# EAGLE design Stepper (EAGLE 9.6.2)
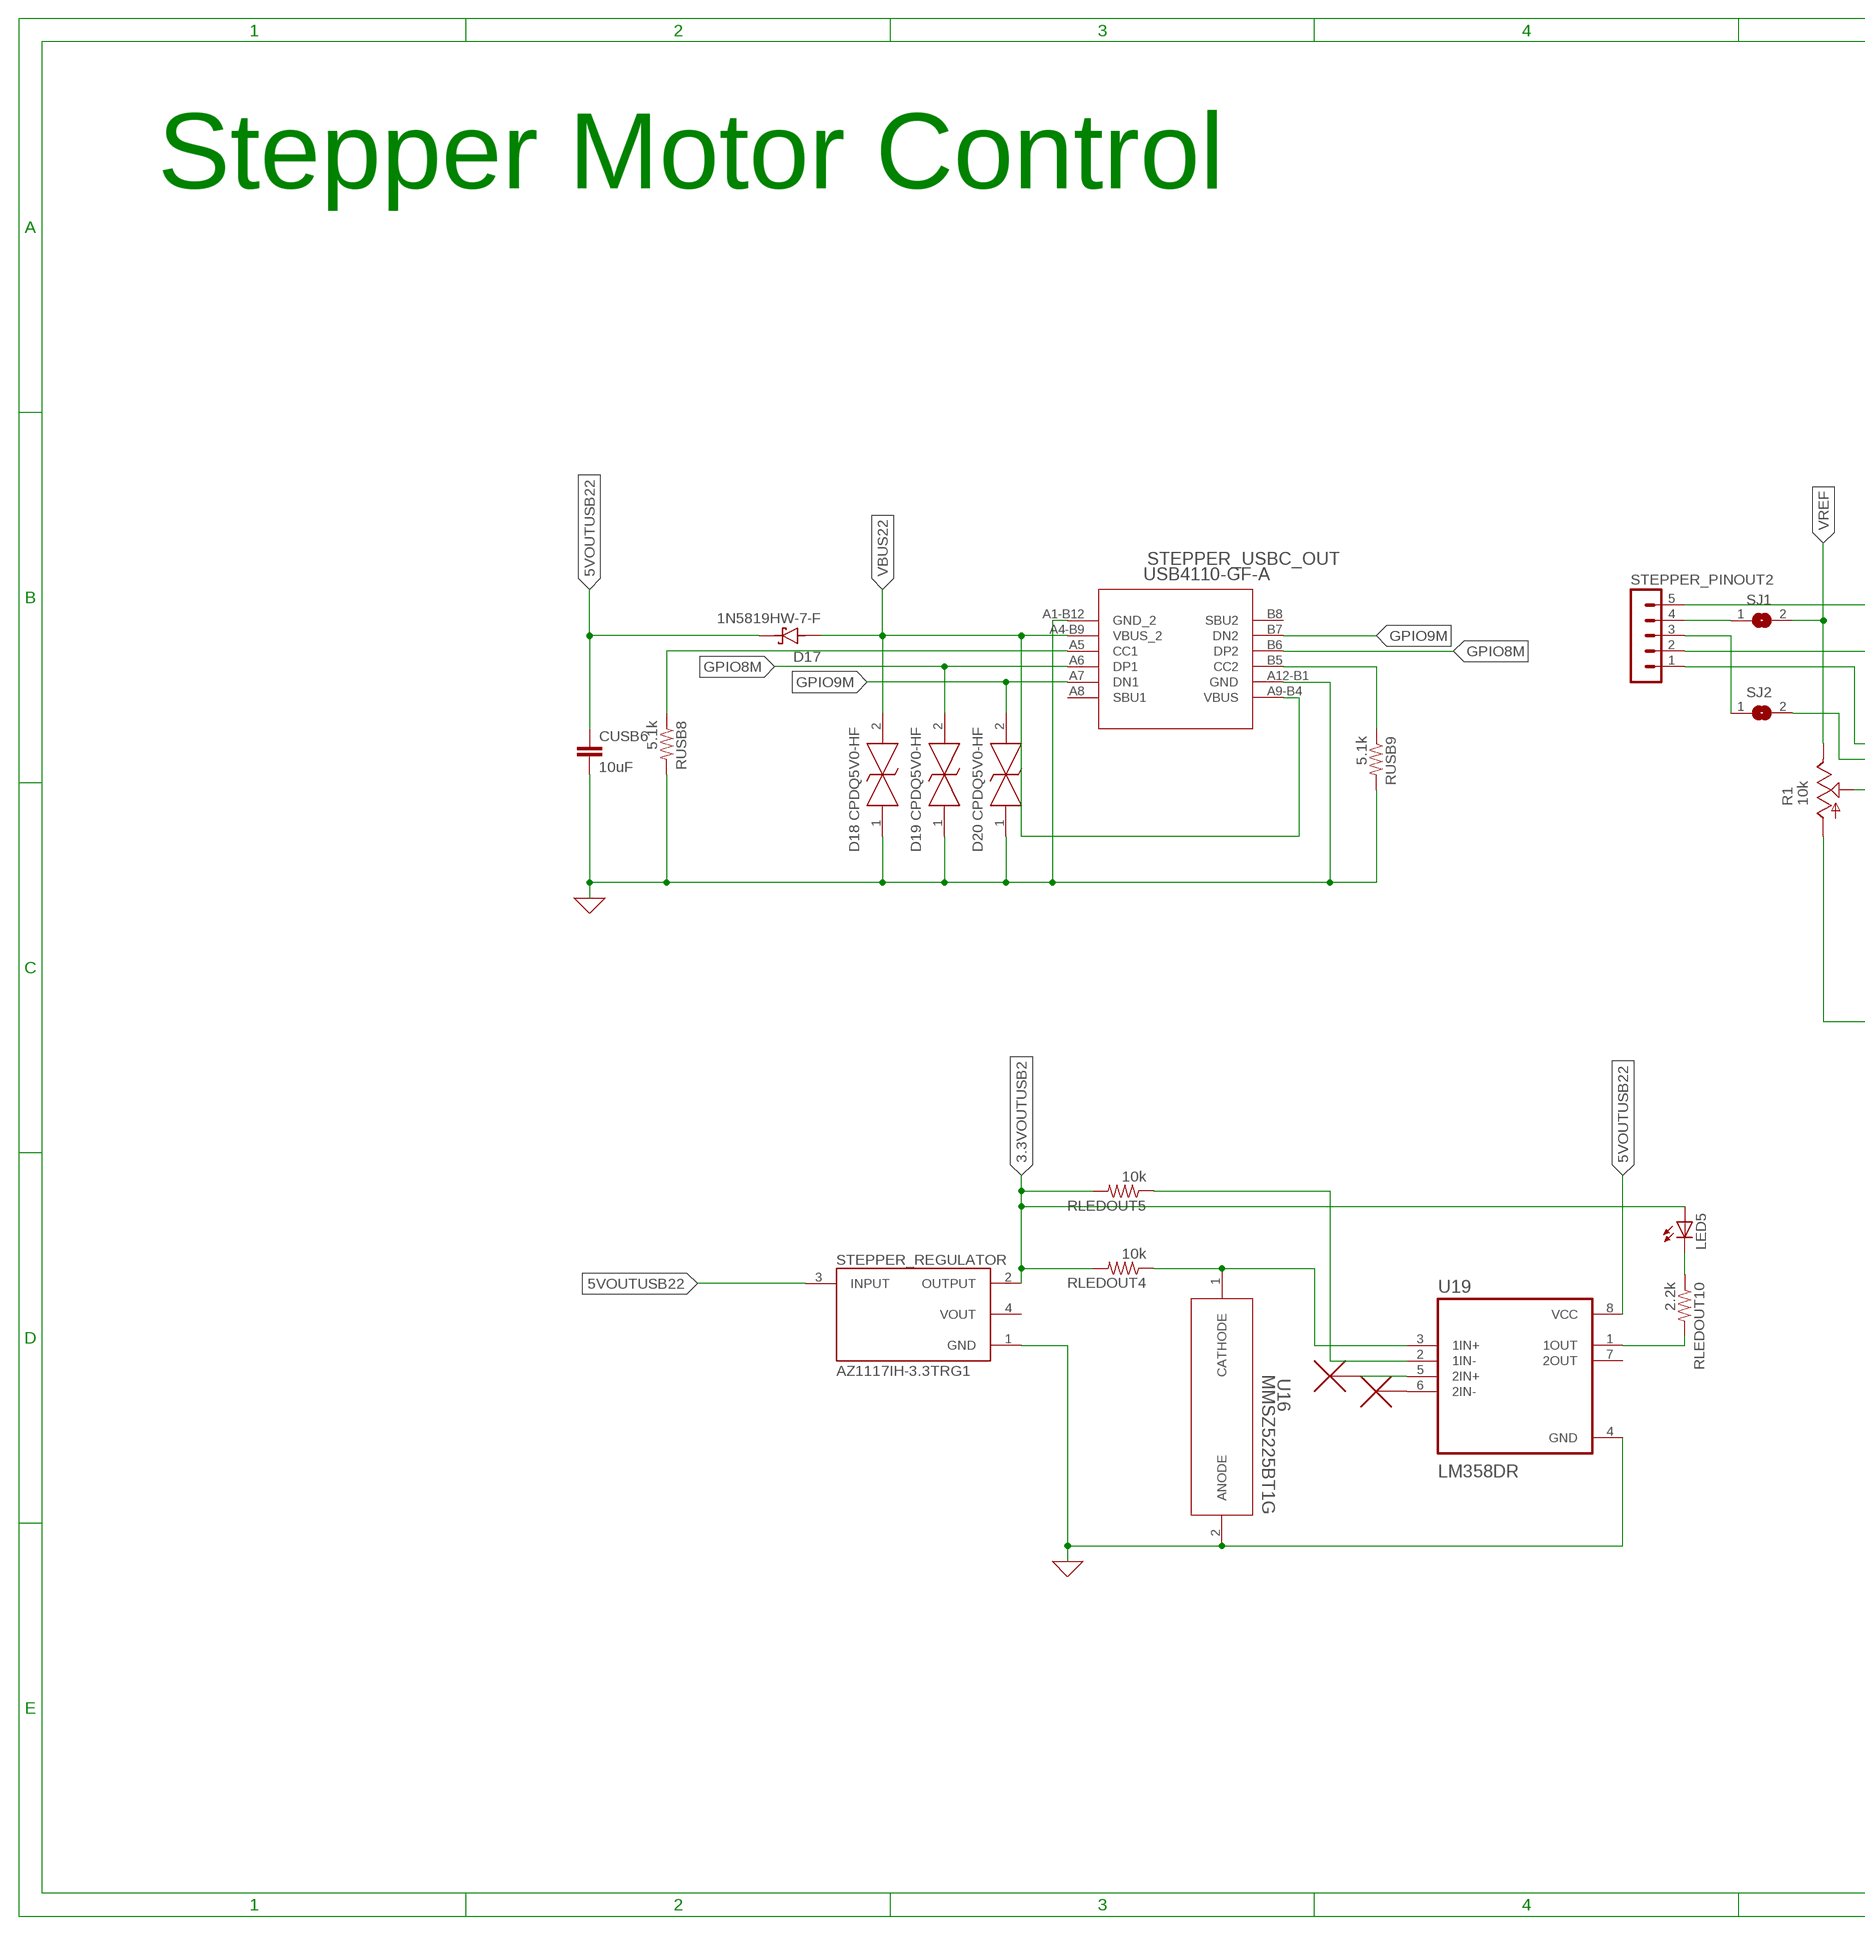
[diagram p0: schematic, sheet 1, part 1 of 2]
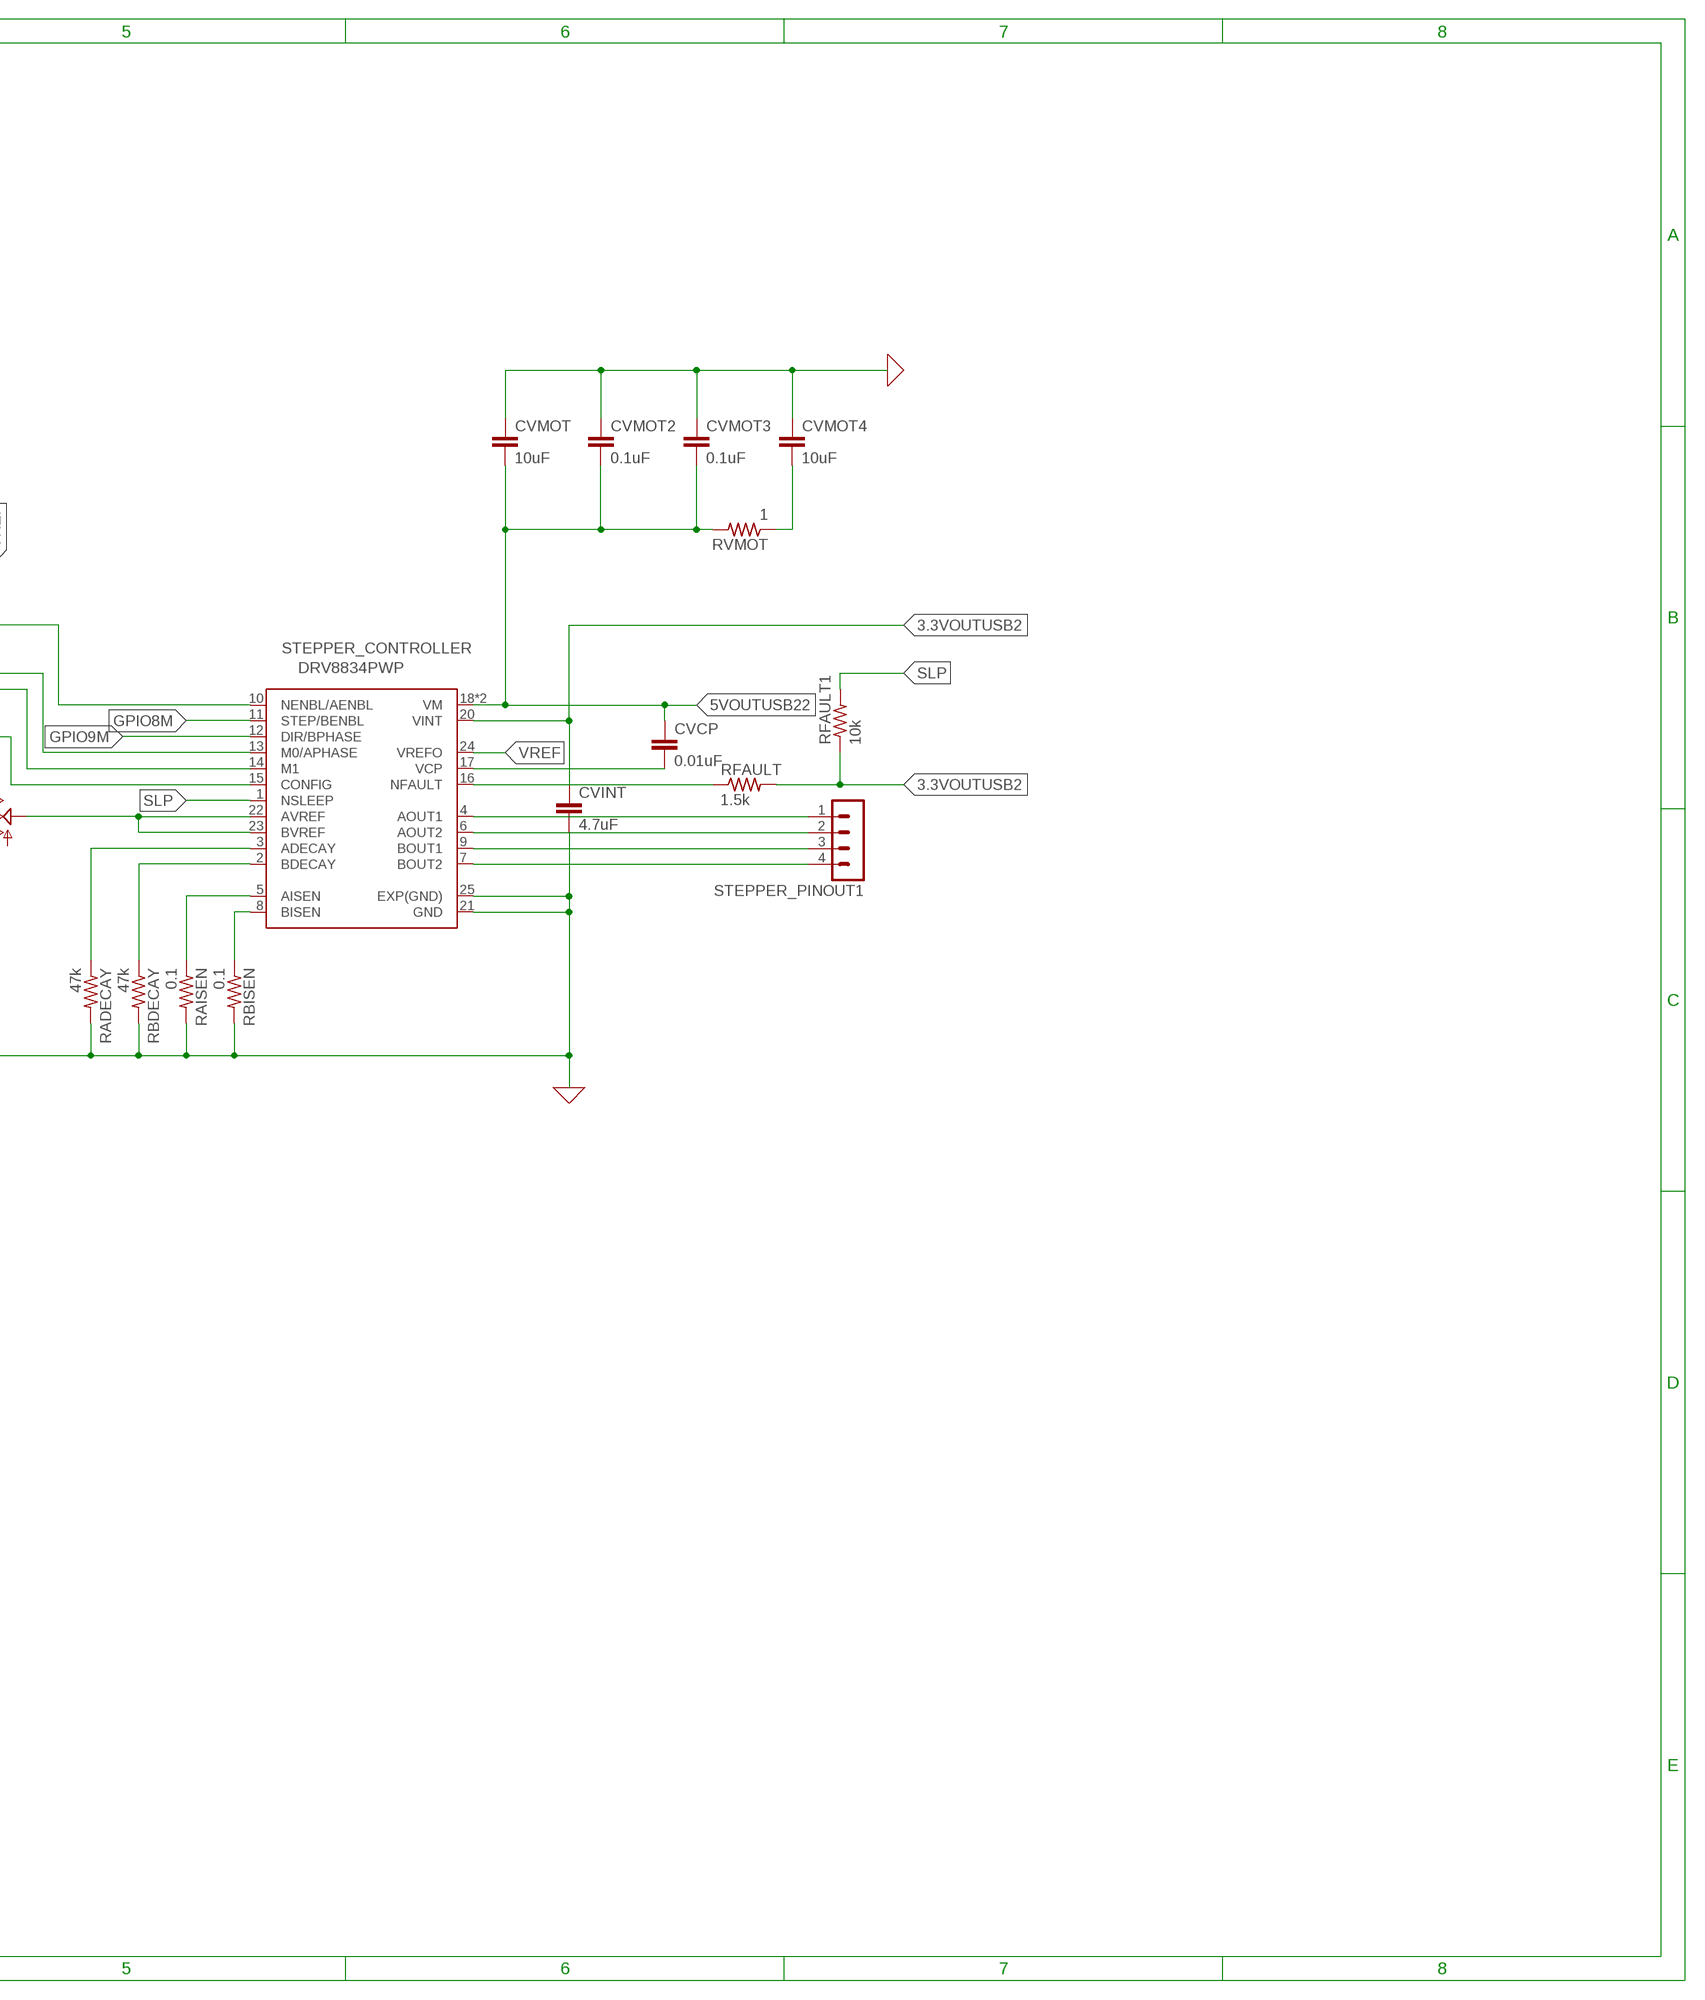
[diagram p1: schematic, sheet 1, part 2 of 2]

## Parts
CUSB6  10uF  C-EUC0805  [C0805]
CVCP  0.01uF  C-EUC0805  [C0805]
CVINT  4.7uF  C-EUC0805  [C0805]
CVMOT  10uF  C-EUC0805  [C0805]
CVMOT2  0.1uF  C-EUC0805  [C0805]
CVMOT3  0.1uF  C-EUC0805  [C0805]
CVMOT4  10uF  C-EUC0805  [C0805]
D17  1N5819HW-7-F  [SOD3715X145N]
D18  CPDQ5V0-HF  [MBTB-D-SOD-923F-IMP-0402]
D19  CPDQ5V0-HF  [MBTB-D-SOD-923F-IMP-0402]
D20  CPDQ5V0-HF  [MBTB-D-SOD-923F-IMP-0402]
LED5  LED  [SMARTLED-TTW]
R1  10k  TRIM_US-3223G  [3223G]
RADECAY  47k  R-US_M0805  [M0805]
RAISEN  0.1  R-US_M0805  [M0805]
RBDECAY  47k  R-US_M0805  [M0805]
RBISEN  0.1  R-US_M0805  [M0805]
RFAULT  1.5k  R-US_M0805  [M0805]
RFAULT1  10k  R-US_M0805  [M0805]
RLEDOUT4  10k  R-US_M0805  [M0805]
RLEDOUT5  10k  R-US_M0805  [M0805]
RLEDOUT10  2.2k  R-US_M0805  [M0805]
RUSB8  5.1k  R-US_M0805  [M0805]
RUSB9  5.1k  R-US_M0805  [M0805]
RVMOT  1  R-US_M0805  [M0805]
SJ1  SJ  [SJ]
SJ2  SJ  [SJ]
STEPPER_CONTROLLER  DRV8834PWP  [SOP65P640X120-25N]
STEPPER_PINOUT1  MA04-1  [MA04-1]
STEPPER_PINOUT2  MA05-1  [MA05-1]
STEPPER_REGULATOR  AZ1117IH-3.3TRG1  [SOT230P700X185-4N]
STEPPER_USBC_OUT  USB4110-GF-A  [USB4110-GF-A_GCT]
U16  MMSZ5225BT1G  [SOD-123_ONS]
U19  LM358DR  [SOIC127P599X175-8N]
U$8  NC_MARKER  (no package)
U$9  NC_MARKER  (no package)

## Nets
3.3VOUTUSB2: CVINT.1 LED5.A@1(A) RFAULT1.1 RFAULT.2 RLEDOUT4.2 RLEDOUT5.2 STEPPER_CONTROLLER.20(VINT) STEPPER_REGULATOR.2(OUTPUT)
5VOUTUSB22: CUSB6.1 CVCP.1 CVMOT2.2 CVMOT3.2 CVMOT.2 D17.C(K) RVMOT.2 STEPPER_CONTROLLER.18(VM) STEPPER_CONTROLLER.19(VM) STEPPER_REGULATOR.3(INPUT) U19.8(VCC)
GND: CUSB6.2 CVINT.2 CVMOT2.1 CVMOT3.1 CVMOT4.1 CVMOT.1 D18.1(K) D19.1(K) D20.1(K) R1.1(A) RADECAY.2 RAISEN.2 RBDECAY.2 RBISEN.2 RUSB8.2 RUSB9.2 STEPPER_CONTROLLER.21(GND) STEPPER_CONTROLLER.25(EXP(GND)) STEPPER_REGULATOR.1(GND) STEPPER_USBC_OUT.A1-B12(GND_2) STEPPER_USBC_OUT.A12-B1(GND) U16.2(ANODE) U19.4(GND)
GPIO8M: D19.2(A) STEPPER_CONTROLLER.11(STEP/BENBL) STEPPER_USBC_OUT.A6(DP1) STEPPER_USBC_OUT.B6(DP2)
GPIO9M: D20.2(A) STEPPER_CONTROLLER.12(DIR/BPHASE) STEPPER_USBC_OUT.A7(DN1) STEPPER_USBC_OUT.B7(DN2)
N$20: CVMOT4.2 RVMOT.1
N$21: RBISEN.1 STEPPER_CONTROLLER.8(BISEN)
N$23: RAISEN.1 STEPPER_CONTROLLER.5(AISEN)
N$24: RBDECAY.1 STEPPER_CONTROLLER.2(BDECAY)
N$25: RADECAY.1 STEPPER_CONTROLLER.3(ADECAY)
N$27: RFAULT.1 STEPPER_CONTROLLER.16(NFAULT)
N$28: STEPPER_CONTROLLER.4(AOUT1) STEPPER_PINOUT1.1
N$29: STEPPER_CONTROLLER.6(AOUT2) STEPPER_PINOUT1.2
N$30: STEPPER_CONTROLLER.9(BOUT1) STEPPER_PINOUT1.3
N$31: STEPPER_CONTROLLER.7(BOUT2) STEPPER_PINOUT1.4
N$32: CVCP.2 STEPPER_CONTROLLER.17(VCP)
N$33: R1.2(S) STEPPER_CONTROLLER.22(AVREF) STEPPER_CONTROLLER.23(BVREF)
N$34: SJ1.1 STEPPER_PINOUT2.4
N$35: SJ2.1 STEPPER_PINOUT2.3
N$36: SJ2.2 STEPPER_CONTROLLER.15(CONFIG)
N$37: STEPPER_CONTROLLER.14(M1) STEPPER_PINOUT2.1
N$38: STEPPER_CONTROLLER.13(M0/APHASE) STEPPER_PINOUT2.2
N$72: RUSB8.1 STEPPER_USBC_OUT.A5(CC1)
N$73: RUSB9.1 STEPPER_USBC_OUT.B5(CC2)
N$82: RLEDOUT4.1 U16.1(CATHODE) U19.3(1IN+)
N$83: RLEDOUT5.1 U19.2(1IN-)
N$84: RLEDOUT10.2 U19.1(1OUT)
N$87: U19.6(2IN-) U$9.P$1
N$88: LED5.C@1(C) RLEDOUT10.1
N$89: U19.5(2IN+) U$8.P$1
N$90: STEPPER_CONTROLLER.10(NENBL/AENBL) STEPPER_PINOUT2.5
SLP: RFAULT1.2 STEPPER_CONTROLLER.1(NSLEEP)
VBUS22: D17.A D18.2(A) STEPPER_USBC_OUT.A4-B9(VBUS_2) STEPPER_USBC_OUT.A9-B4(VBUS)
VREF: R1.3(E) SJ1.2 STEPPER_CONTROLLER.24(VREFO)
Unconnected: STEPPER_REGULATOR.4(VOUT) STEPPER_USBC_OUT.A8(SBU1) STEPPER_USBC_OUT.B8(SBU2) U19.7(2OUT)

## Notes on the sheet
- Stepper Motor Control

## Library data of the parts
CUSB6 CVCP CVINT CVMOT CVMOT2-CVMOT4 = rcl:C-EU: CAPACITOR, European symbol; SPICEPREFIX: C
D17 = 1N5819HW-7-F:1N5819HW-7-F: 1N5819HW Series 40 V 1 A Surface Mount Schottky Barrier Rectifier - SOD-123 Check availability <https://pricing.snapeda.com/parts/1N5819HW-7-F/Diodes%20Inc./view-part?ref=eda>; AVAILABILITY: In Stock; CHECK_PRICES: https://www.snapeda.com/parts/1N5819HW-7-F/Diodes+Inc./view-part/?ref=eda; DESCRIPTION: Diode Schottky 1A 40V SOD123 | Diodes Inc 1N5819HW-7-F; MF: Diodes Inc.; MP: 1N5819HW-7-F; PACKAGE: SOD-123 Fairchild Semiconductor; PRICE: None; PURCHASE-URL: https://www.snapeda.com/api/url_track_click_mouser/?unipart_id=42272&manufacturer=Diodes Inc.&part_name=1N5819HW-7-F&search_term=1n5819hw-7-f; SNAPEDA_LINK: https://www.snapeda.com/parts/1N5819HW-7-F/Diodes+Inc./view-part/?ref=snap
D18-D20 = CPDQ5V0-HF:CPDQ5V0-HF: ESD Suppressors / TVS Diodes SMD ESD Diode 5V Bi-Direction Source: Datasheet <https://componentsearchengine.com/Datasheets/1/CPDQ5V0-HF.pdf> Check availability <https://pricing.snapeda.com/parts/CPDQ5V0-HF/Comchip%20Technology/view-part?ref=eda>; AVAILABILITY: In Stock; CHECK_PRICES: https://www.snapeda.com/parts/CPDQ5V0-HF/Comchip+Technology/view-part/?ref=eda; DESCRIPTION: 18.6V Clamp 9.4A (8/20µs) Ipp Tvs Diode Surface Mount 0402/SOD-923F; MF: Comchip Technology; MP: CPDQ5V0-HF; PACKAGE: 0402 Comchip; PRICE: None; PURCHASE-URL: https://www.snapeda.com/api/url_track_click_mouser/?unipart_id=809934&manufacturer=Comchip Technology&part_name=CPDQ5V0-HF&search_term=cpdq5v0-hf; SNAPEDA_LINK: https://www.snapeda.com/parts/CPDQ5V0-HF/Comchip+Technology/view-part/?ref=snap
LED5 = adafruit:LED: LED OSRAM: - CHIPLED LG R971, LG N971, LY N971, LG Q971, LY Q971, LO R971, LY R971 LH N974, LH R974 LS Q976, LO Q976, LY Q976 LO Q996 - Hyper CHIPLED LW Q18S LB Q993, LB Q99A, LB R99A - SideLED LS A670, LO A670, LY A670, LG A670, LP A670 LB A673, LV A673, LT A673, LW A673 LH A674 LY A675 LS A676, LA A676, LO A676, LY A676, LW A676 LS A679, LY A679, LG A679 - Hyper Micro SIDELED® LS Y876, LA Y876, LO Y876, LY Y876 LT Y87S - SmartLED LW L88C, LW L88S LB L89C, LB L89S, LG L890 LS L89K, LO L89K, LY L89K LS L896, LA L896, LO L896, LY L896 - TOPLED LS T670, LO T670, LY T670, LG T670, LP T670 LSG T670, LSP T670, LSY T670, LOP T670, LYG T670 LG T671, LOG T671, LSG T671 LB T673, LV T673, LT T673, LW T673 LH T674 LS T676, LA T676, LO T676, LY T676, LB T676, LH T676, LSB T676, LW T676 LB T67C, LV T67C, LT T67C, LS T67K, LO T67K, LY T67K, LW E67C LS E67B, LA E67B, LO E67B, LY E67B, LB E67C, LV E67C, LT E67C LW T67C LS T679, LY T679, LG T679 LS T770, LO T770, LY T770, LG T770, LP T770 LB T773, LV T773, LT T773, LW T773 LH T774 LS E675, LA E675, LY E675, LS T675 LS T776, LA T776, LO T776, LY T776, LB T776 LHGB T686 LT T68C, LB T68C - Hyper Mini TOPLED® LB M676 - Mini TOPLED Santana® LG M470 LS M47K, LO M47K, LY M47K Source: http://www.osram.convergy.de/
R1 = pot:TRIM_US-: POTENTIOMETER
RADECAY RAISEN RBDECAY RBISEN RFAULT RFAULT1 RLEDOUT4 RLEDOUT5 RLEDOUT10 RUSB8 RUSB9 RVMOT = rcl:R-US_: RESISTOR, American symbol; SPICEPREFIX: R
SJ1 SJ2 = jumper:SJ: SMD solder JUMPER
STEPPER_CONTROLLER = DRV8834PWP:DRV8834PWP: 2.2A Low Voltage Stepper w/ 32-step Indexer or Dual Brushed DC Motor Driver (Indexer or PH/EN Ctrl) 24-HTSSOP -40 to 85 Check availability <https://pricing.snapeda.com/parts/DRV8834PWP/Texas%20Instruments/view-part?ref=eda>; AVAILABILITY: In Stock; DESCRIPTION: 11-V, 1.5-A, dual H-bridge or stepper motor driver with 1/32 microstep indexer; MF: Texas Instruments; MP: DRV8834PWP; PACKAGE: HTSSOP-24 Texas Instruments; PRICE: None; PURCHASE-URL: https://pricing.snapeda.com/search?q=DRV8834PWP&ref=eda
STEPPER_PINOUT1 = con-lstb:MA04-1: PIN HEADER; OC_FARNELL: unknown; OC_NEWARK: unknown
STEPPER_PINOUT2 = con-lstb:MA05-1: PIN HEADER; OC_FARNELL: unknown; OC_NEWARK: unknown
STEPPER_REGULATOR = AZ1117IH-3.3TRG1:AZ1117IH-3.3TRG1: Check availability <https://pricing.snapeda.com/parts/AZ1117IH-3.3TRG1/Diodes%20Inc./view-part?ref=eda>; AVAILABILITY: In Stock; CHECK_PRICES: https://www.snapeda.com/parts/AZ1117IH-3.3TRG1/Diodes+Inc./view-part/?ref=eda; DESCRIPTION: Linear Voltage Regulator IC Positive Fixed 1 Output 1A SOT-223-3; MF: Diodes Inc.; MP: AZ1117IH-3.3TRG1; PACKAGE: SOT-223 Diodes Inc.; PRICE: None; PURCHASE-URL: https://www.snapeda.com/api/url_track_click_mouser/?unipart_id=490259&manufacturer=Diodes Inc.&part_name=AZ1117IH-3.3TRG1&search_term=az1117ih-3.3trg1; SNAPEDA_LINK: https://www.snapeda.com/parts/AZ1117IH-3.3TRG1/Diodes+Inc./view-part/?ref=snap
STEPPER_USBC_OUT = USB4110-GF-A:USB4110-GF-A; COPYRIGHT: Copyright (C) 2023 Ultra Librarian. All rights reserved.; MANUFACTURER_PART_NUMBER: USB4110-GF-A; MFR_NAME: Global Connector Technology
U16 = MMSZ5225BT1G:MMSZ5225BT1G; COPYRIGHT: Copyright (C) 2023 Ultra Librarian. All rights reserved.; MANUFACTURER_PART_NUMBER: MMSZ5225BT1G; MFR_NAME: onsemi
U19 = LM358DR:LM358DR: Check availability <https://pricing.snapeda.com/parts/LM358DR/Texas%20Instruments/view-part?ref=eda>; AVAILABILITY: In Stock; CHECK_PRICES: https://www.snapeda.com/parts/LM358DR/Texas+Instruments/view-part/?ref=eda; DESCRIPTION: Dual, 30-V, 700-kHz operational amplifier; MF: Texas Instruments; MP: LM358DR; PACKAGE: SOIC-8 Texas Instruments; PRICE: None; PURCHASE-URL: https://www.snapeda.com/api/url_track_click_mouser/?unipart_id=6639&manufacturer=Texas Instruments&part_name=LM358DR&search_term=lm358dr; SNAPEDA_LINK: https://www.snapeda.com/parts/LM358DR/Texas+Instruments/view-part/?ref=snap
U$8 U$9 = NC_MARKER:NC_MARKER

## Board
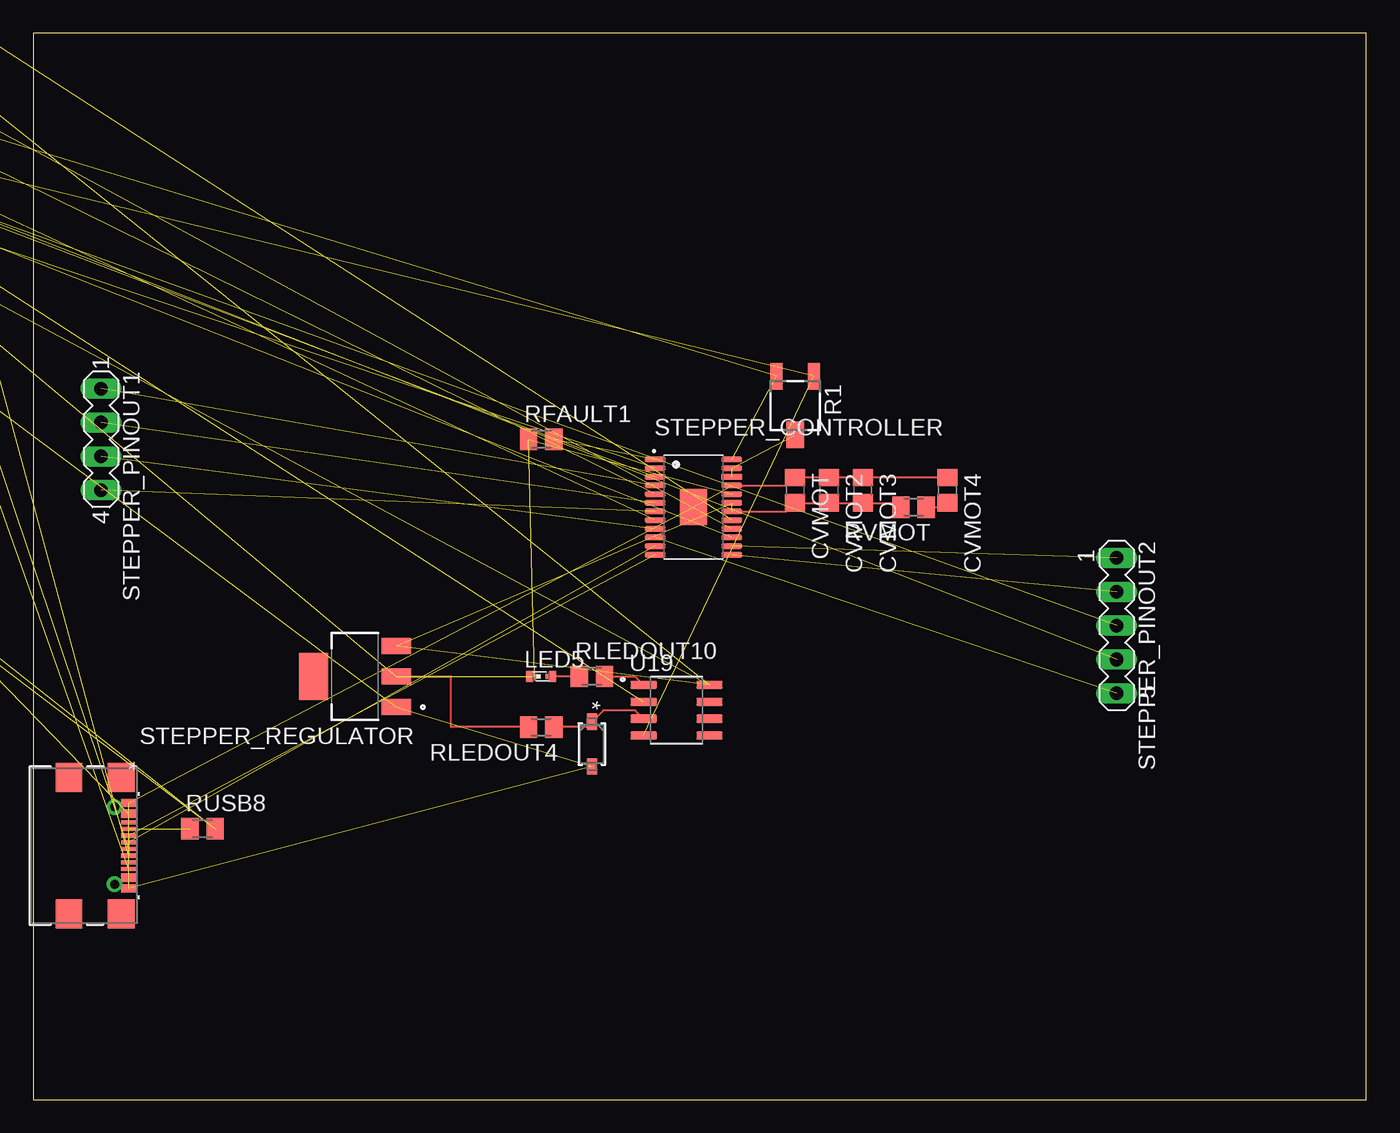
[diagram p2: board, top side]

Size 100 x 80 mm. Coordinates in mm from the lower left corner, seen from the top.
Outline: 0,0 100,0 100,80 0,80 0,0
Copper layers (1*16): Top 0.035mm / dielectric 1.5mm / Bottom 0.035mm
Design rules "default": minimum track width 6mil, minimum drill 0.35mm, track to track 6mil, track to pad 6mil, pad to pad 6mil, via to via 6mil, smd to smd 6mil, copper to edge 40mil, drill to drill 6mil, minimum pad ring 10mil, minimum via ring 8mil, stop-mask expansion 4mil, vias tented up to drill 0mil, thermal gap 10mil

### Footprints (pad centres in the part's own frame; a part is rotated, then mirrored left to right if it is on the bottom)
C0805 = smd 1.3 x 1.5: 1 -0.95,0; 2 0.95,0
SOD3715X145N = smd 1.21 x 0.73: A 1.68,0; C -1.68,0
MBTB-D-SOD-923F-IMP-0402 = smd 0.5 x 0.6: 1 -0.525,0; 2 0.525,0
SMARTLED-TTW = smd 0.8 x 0.5: A 0,-0.875; C 0,0.875 | smd 0.35 x 0.35: A@1 0,-0.5; C@1 0,0.5
3223G = smd 2 x 0.9: 1 -2.2,1.4; 3 -2.2,-1.4 | smd 2 x 1.3: 2 2.2,0
M0805 = smd 1.3 x 1.6: 1 -0.95,0; 2 0.95,0
SJ = smd 1.168 x 1.6: 1 -0.762,0; 2 0.762,0
SOP65P640X120-25N = smd 1.57 x 0.41: 1 -2.87,3.575; 2 -2.87,2.925; 3 -2.87,2.275; 4 -2.87,1.625; 5 -2.87,0.975; 6 -2.87,0.325; 7 -2.87,-0.325; 8 -2.87,-0.975; 9 -2.87,-1.625; 10 -2.87,-2.275; 11 -2.87,-2.925; 12 -2.87,-3.575; 13 2.87,-3.575; 14 2.87,-2.925; 15 2.87,-2.275; 16 2.87,-1.625; 17 2.87,-0.975; 18 2.87,-0.325; 19 2.87,0.325; 20 2.87,0.975; 21 2.87,1.625; 22 2.87,2.275; 23 2.87,2.925; 24 2.87,3.575 | smd 2.025 x 2.68: 25 0,0
MA04-1 = drill 1.016 long: 1 -3.81,0; 2 -1.27,0; 3 1.27,0; 4 3.81,0
MA05-1 = drill 1.016 long: 1 -5.08,0; 2 -2.54,0; 3 0,0; 4 2.54,0; 5 5.08,0
SOT230P700X185-4N = smd 2.2 x 1.2: 1 -3.1,2.3; 2 -3.1,0; 3 -3.1,-2.3 | smd 2.2 x 3.5: 4 3.1,0
USB4110-GF-A_GCT = drill 0.66 pad 0.66: 13 -2.896,2.286; 14 2.896,2.286 | smd 2.159 x 2.007: 15 -5.11,2.788; 16 5.11,2.788; 17 -5.11,-1.142; 18 5.11,-1.142 | smd 0.61 x 1.143: A1-B12 -3.2,3.363; A4-B9 -2.4,3.363; A9-B4 2.4,3.363; A12-B1 3.2,3.363 | smd 0.305 x 1.143: A5 -1.25,3.363; A6 -0.25,3.363; A7 0.25,3.363; A8 1.25,3.363; B5 1.75,3.363; B6 0.75,3.363; B7 -0.75,3.363; B8 -1.75,3.363
SOD-123_ONS = smd 1.219 x 0.762: 1 -1.676,0; 2 1.676,0
SOIC127P599X175-8N = smd 1.97 x 0.6: 1 -2.47,1.905; 2 -2.47,0.635; 3 -2.47,-0.635; 4 -2.47,-1.905; 5 2.47,-1.905; 6 2.47,-0.635; 7 2.47,0.635; 8 2.47,1.905

### Placement (x,y rotation side)
CUSB6  -72.39,87.63 0 top  (outside the outline)
CVCP  -26.67,93.98 0 top  (outside the outline)
CVINT  -34.29,93.98 0 top  (outside the outline)
CVMOT  57.15,45.72 270 top
CVMOT2  59.69,45.72 270 top
CVMOT3  62.23,45.72 270 top
CVMOT4  68.58,45.72 270 top
D17  -64.77,93.98 0 top  (outside the outline)
D18  -81.28,92.71 0 top  (outside the outline)
D19  -15.24,99.06 0 top  (outside the outline)
D20  -20.32,99.06 0 top  (outside the outline)
LED5  38.1,31.75 270 top
R1  57.15,52.07 270 top
RADECAY  -43.18,81.28 0 top  (outside the outline)
RAISEN  -38.1,87.63 0 top  (outside the outline)
RBDECAY  -53.34,81.28 0 top  (outside the outline)
RBISEN  -46.99,87.63 0 top  (outside the outline)
RFAULT  -29.21,87.63 0 top  (outside the outline)
RFAULT1  38.1,49.53 0 top
RLEDOUT4  38.1,27.94 180 top
RLEDOUT5  -33.02,81.28 0 top  (outside the outline)
RLEDOUT10  41.91,31.75 0 top
RUSB8  12.7,20.32 0 top
RUSB9  -19.05,93.98 0 top  (outside the outline)
RVMOT  66.04,44.45 180 top
SJ1  -71.12,92.71 0 top  (outside the outline)
SJ2  -76.2,92.71 0 top  (outside the outline)
STEPPER_CONTROLLER  49.53,44.45 0 top
STEPPER_PINOUT1  5.08,49.53 270 top
STEPPER_PINOUT2  81.28,35.56 270 top
STEPPER_REGULATOR  24.13,31.75 180 top
STEPPER_USBC_OUT  3.81,19.05 270 top
U16  41.91,26.67 270 top
U19  48.26,29.21 0 top

### Tracks (layer width: path | path; a pad name or v marks a point on that pad's centre or on a via)
3.3VOUTUSB2  (6 unrouted)
  Top 0.152: STEPPER_REGULATOR.2 31.35,31.75 31.35,27.94 RLEDOUT4.2
5VOUTUSB22  (6 unrouted)
  Top 0.152: STEPPER_CONTROLLER.18 56.51,44.12 CVMOT.2 CVMOT2.2 CVMOT3.2 64.77,44.77 RVMOT.2
GND  (18 unrouted)
  Top 0.152: CVMOT4.1 CVMOT3.1 CVMOT2.1 CVMOT.1 56.55,46.08 STEPPER_CONTROLLER.21
GPIO8M  (3 unrouted)
GPIO9M  (3 unrouted)
N$20
  Top 0.152: RVMOT.1 68.26,44.45 CVMOT4.2
N$21  (1 unrouted)
N$23  (1 unrouted)
N$24  (1 unrouted)
N$25  (1 unrouted)
N$27  (1 unrouted)
N$28  (1 unrouted)
N$29  (1 unrouted)
N$30  (1 unrouted)
N$31  (1 unrouted)
N$32  (1 unrouted)
N$33  (2 unrouted)
N$34  (1 unrouted)
N$35  (1 unrouted)
N$36  (1 unrouted)
N$37  (1 unrouted)
N$38  (1 unrouted)
N$72  (1 unrouted)
N$73  (1 unrouted)
N$82
  Top 0.152: RLEDOUT4.1 41.5,27.94 U16.1 42.77,29.21 45.16,29.21 U19.3
N$83  (1 unrouted)
N$84
  Top 0.152: RLEDOUT10.2 45.16,31.75 U19.1
N$88
  Top 0.152: RLEDOUT10.1 LED5.C@1
N$90  (1 unrouted)
SLP  (1 unrouted)
VBUS22  (3 unrouted)
VREF  (2 unrouted)